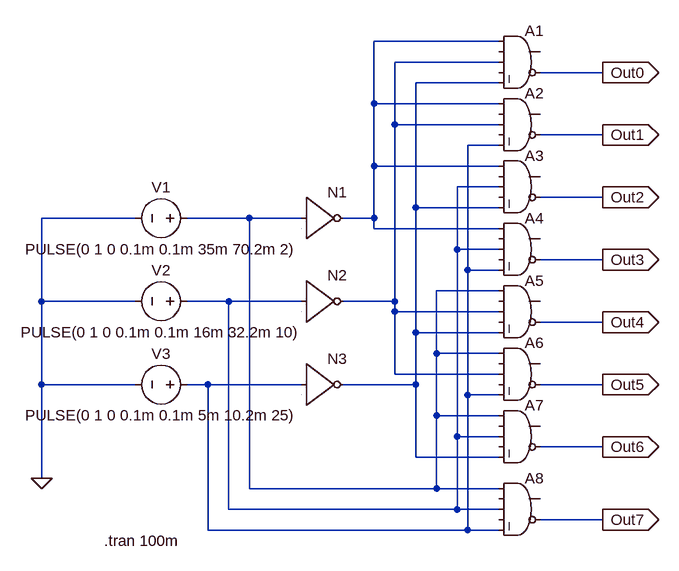
[diagram p0: schematic Decoder.asc]
Decoder.asc, the LTspice schematic file:
Version 4
SHEET 1 880 712
WIRE 416 -160 224 -160
WIRE 416 -128 256 -128
WIRE 576 -112 480 -112
WIRE 416 -96 288 -96
WIRE 224 -64 224 -160
WIRE 416 -64 224 -64
WIRE 256 -32 256 -128
WIRE 416 -32 256 -32
WIRE 576 -16 480 -16
WIRE 416 0 368 0
WIRE 224 32 224 -64
WIRE 416 32 224 32
WIRE 416 64 352 64
WIRE 576 80 480 80
WIRE 288 96 288 -96
WIRE 416 96 288 96
WIRE -144 112 -288 112
WIRE 32 112 -64 112
WIRE 112 112 32 112
WIRE 224 112 224 32
WIRE 224 112 176 112
WIRE 224 128 224 112
WIRE 416 128 224 128
WIRE 352 160 352 64
WIRE 416 160 352 160
WIRE 576 176 480 176
WIRE 368 192 368 0
WIRE 416 192 368 192
WIRE 416 224 320 224
WIRE -288 240 -288 112
WIRE -144 240 -288 240
WIRE 0 240 -64 240
WIRE 112 240 0 240
WIRE 256 240 256 -32
WIRE 256 240 176 240
WIRE 256 256 256 240
WIRE 416 256 256 256
WIRE 576 272 480 272
WIRE 288 288 288 96
WIRE 416 288 288 288
WIRE 320 320 320 224
WIRE 416 320 320 320
WIRE 256 352 256 256
WIRE 416 352 256 352
WIRE -288 368 -288 240
WIRE -144 368 -288 368
WIRE -32 368 -64 368
WIRE 112 368 -32 368
WIRE 288 368 288 288
WIRE 288 368 176 368
WIRE 576 368 480 368
WIRE 368 384 368 192
WIRE 416 384 368 384
WIRE 320 416 320 320
WIRE 416 416 320 416
WIRE 352 448 352 160
WIRE 416 448 352 448
WIRE 576 464 480 464
WIRE 288 480 288 368
WIRE 416 480 288 480
WIRE -288 512 -288 368
WIRE 32 528 32 112
WIRE 320 528 320 416
WIRE 320 528 32 528
WIRE 416 528 320 528
WIRE 0 560 0 240
WIRE 352 560 352 448
WIRE 352 560 0 560
WIRE 416 560 352 560
WIRE 576 576 480 576
WIRE -32 592 -32 368
WIRE 368 592 368 384
WIRE 368 592 -32 592
WIRE 416 592 368 592
FLAG -288 512 0
FLAG 576 -112 Out0
IOPIN 576 -112 Out
FLAG 576 -16 Out1
IOPIN 576 -16 Out
FLAG 576 80 Out2
IOPIN 576 80 Out
FLAG 576 176 Out3
IOPIN 576 176 Out
FLAG 576 272 Out4
IOPIN 576 272 Out
FLAG 576 368 Out5
IOPIN 576 368 Out
FLAG 576 464 Out6
IOPIN 576 464 Out
FLAG 576 576 Out7
IOPIN 576 576 Out
SYMBOL voltage -48 112 R90
WINDOW 0 -32 56 VBottom 2
WINDOW 3 32 56 VTop 2
WINDOW 123 0 0 Left 2
WINDOW 39 0 0 Left 2
SYMATTR InstName V1
SYMATTR Value PULSE(0 1 0 0.1m 0.1m 35m 70.2m 2)
SYMBOL voltage -48 240 R90
WINDOW 0 -32 56 VBottom 2
WINDOW 3 32 56 VTop 2
WINDOW 123 0 0 Left 2
WINDOW 39 0 0 Left 2
SYMATTR InstName V2
SYMATTR Value PULSE(0 1 0 0.1m 0.1m 16m 32.2m 10)
SYMBOL voltage -48 368 R90
WINDOW 0 -32 56 VBottom 2
WINDOW 3 32 56 VTop 2
WINDOW 123 0 0 Left 2
WINDOW 39 0 0 Left 2
SYMATTR InstName V3
SYMATTR Value PULSE(0 1 0 0.1m 0.1m 5m 10.2m 25)
SYMBOL Digital\\inv 112 48 R0
SYMATTR InstName N1
SYMBOL Digital\\inv 112 176 R0
SYMATTR InstName N2
SYMBOL Digital\\inv 112 304 R0
SYMATTR InstName N3
SYMBOL Digital\\and 448 0 R0
SYMATTR InstName A3
SYMBOL Digital\\and 448 96 R0
SYMATTR InstName A4
SYMBOL Digital\\and 448 192 R0
SYMATTR InstName A5
SYMBOL Digital\\and 448 288 R0
SYMATTR InstName A6
SYMBOL Digital\\and 448 384 R0
SYMATTR InstName A7
SYMBOL Digital\\and 448 -96 R0
SYMATTR InstName A2
SYMBOL Digital\\and 448 496 R0
SYMATTR InstName A8
SYMBOL Digital\\and 448 -192 R0
SYMATTR InstName A1
TEXT -192 608 Left 2 !.tran 100m

The netlist it stands for:
* Decoder.asc
V1 N006 0 PULSE(0 1 0 0.1m 0.1m 35m 70.2m 2)
V2 N005 0 PULSE(0 1 0 0.1m 0.1m 16m 32.2m 10)
V3 N004 0 PULSE(0 1 0 0.1m 0.1m 5m 10.2m 25)
A§N1 N006 0 0 0 0 N001 0 0 BUF
A§N2 N005 0 0 0 0 N002 0 0 BUF
A§N3 N004 0 0 0 0 N003 0 0 BUF
A3 N001 0 N005 0 N003 Out2 0 0 AND
A4 N001 0 N005 0 N004 Out3 0 0 AND
A5 N006 0 N002 0 N003 Out4 0 0 AND
A6 N006 0 N002 0 N004 Out5 0 0 AND
A7 N006 0 N005 0 N003 Out6 0 0 AND
A2 N001 0 N002 0 N004 Out1 0 0 AND
A8 N006 0 N005 0 N004 Out7 0 0 AND
A1 N001 0 N002 0 N003 Out0 0 0 AND
.tran 100m
.backanno
.end

* Results of the author's LTspice run, read from the files saved beside the schematic
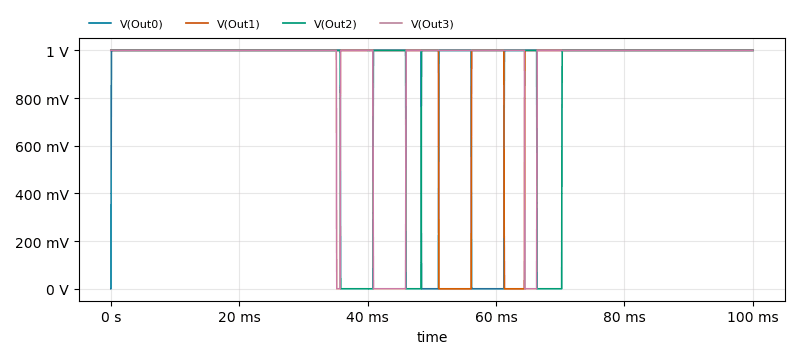
[diagram p1: Transient Analysis of Decoder.asc, plotted from the saved traces]
* Transient Analysis, 1 run:
*   V(Out0): min 0 V, max 1 V, average 921.5 mV, rms 959.7 mV, last 1 V
*   V(Out1): min 0 V, max 1 V, average 917 mV, rms 957.4 mV, last 1 V
*   V(Out2): min 0 V, max 1 V, average 885.9 mV, rms 940.9 mV, last 1 V
*   V(Out3): min 0 V, max 1 V, average 924 mV, rms 960.9 mV, last 1 V